# Altium project Course work.PrjPcb (part 3 of 3)
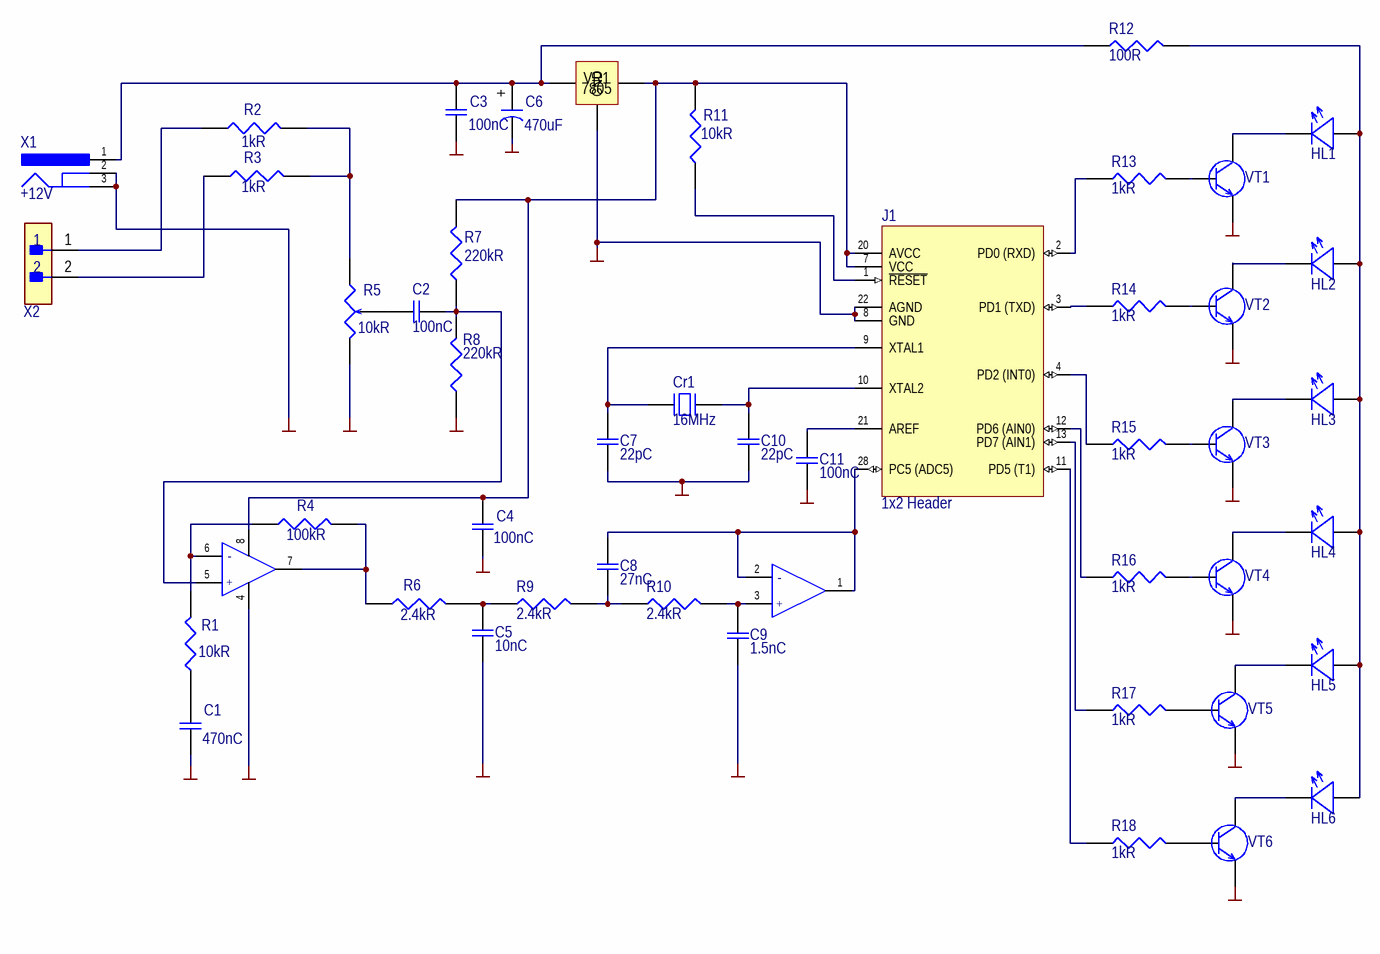
[diagram p2: CW.SchDoc]

## Sheet CW.SchDoc (continued)

### Library data of the parts (continued)
VT1-VT6 = BC639: TRANS NPN 80V 1A TO-92; Manufacturer: ON Semiconductor / Fairchild; Max Power Dissipation: 625mW; Transition Frequency: 200MHz; Emitter Base Voltage (VEBO): 5V; Collector Emitter Saturation Voltage: 500mV; Element Configuration: Single; Frequency: 100MHz; hFE Min: 40; Number of Elements: 1; Power Dissipation: 1W; Supplier 1: Avnet; Supplier Part Number 1: BC639; Manufacturer Part Number: BC639; RoHS: No; Category: BJTs; Stock 1: 10708; Pricing 1: 5342=0,06646, 5400=0,06552, 11000=0,06365, 27000=0,06224, 54000=0,05990, 270000=0,05850, 540000=0,05710 (USD); Mount: Through Hole; Case/Package: TO-92; Number of Pins: 3; Contact Plating: Copper,Tin,Silver; Weight: 0.201g; Min Operating Temperature: -55°C; Max Operating Temperature: 150°C; Package Quantity: 5000; Collector Emitter Voltage (VCEO): 80V; Packaging: Bulk; Max Collector Current: 1A; Polarity: NPN; Collector Emitter Breakdown Voltage: 80V; Gain Bandwidth Product: 200MHz; Voltage Rating (DC): 80V; Current Rating: 1A; Collector Base Voltage (VCBO): 80V; Max Breakdown Voltage: 80V; Collector-emitter Voltage-Max: 500mV; Series: -; Termination: Through Hole; Lead Free: Lead Free; REACH SVHC: No SVHC; RoHS Compliant: No; ComponentLink1URL: https://datasheet.ciiva.com/982/bc639-982480.pdf?src-supplier=Digi-Key; ComponentLink1Description: https://datasheet.ciiva.com/982/bc639-982480.pdf?src-supplier=Digi-Key; ComponentLink2URL: https://datasheet.ciiva.com/986/bc635-637-639rev5-986450.pdf?src-supplier=Digi-Key; ComponentLink2Description: https://datasheet.ciiva.com/986/bc635-637-639rev5-986450.pdf?src-supplier=Digi-Key; ComponentLink3URL: https://datasheet.ciiva.com/17179/bc63916-17179413.pdf?src-supplier=Future+Electronics; ComponentLink3Description: https://datasheet.ciiva.com/17179/bc63916-17179413.pdf?src-supplier=Future+Electronics; ComponentLink4URL: https://datasheet.ciiva.com/1195/5224-1195640.pdf?src-supplier=Element14; ComponentLink4Description: https://datasheet.ciiva.com/1195/5224-1195640.pdf?src-supplier=Element14; ComponentLink5URL: https://datasheet.ciiva.com/1195/5224-1195641.pdf?src-supplier=Element14; ComponentLink5Description: https://datasheet.ciiva.com/1195/5224-1195641.pdf?src-supplier=Element14; ComponentLink6URL: https://datasheet.ciiva.com/1217/5224-1217209.pdf?src-supplier=Farnell; ComponentLink6Description: https://datasheet.ciiva.com/1217/5224-1217209.pdf?src-supplier=Farnell
X1 = KLDX-0202-A: KYCON - KLDX-0202-A - DC Power Connector, Jack, 3.5 A, 2 mm, PCB Mount, Through Hole; Number of Contacts: 2; Gender: Female; Current Rating: 3.5A; Voltage Rating: 24V; Insulation Resistance: 100MR; Supplier 1: Digi-Key; Supplier Part Number 1: 2092-KLDX-0202-A-ND; Manufacturer: Kycon; Manufacturer Part Number: KLDX-0202-A; RoHS: Yes; Category: Connectors; Stock 1: 10383; Pricing 1: 1=0,54000, 10=0,50600, 25=0,45560, 50=0,40480, 100=0,38790, 250=0,35420, 500=0,33734, 1000=0,27831, 2500=0,25300 (USD); Mount: Through Hole; Contact Material: Brass; Contact Plating: Tin; Housing Material: PBT; Color: Black; Min Operating Temperature: -25°C; Max Operating Temperature: 85°C; Packaging: Bag; Termination: Solder; Orientation: Right Angle; Package Quantity: 500; Connector Type: Power; Contact Gender: Female; Series: KLDX; Voltage Rating (DC): 24V; Radiation Hardening: No; Flammability Rating: UL94 V-0; RoHS Compliant: Yes; ComponentLink1URL: http://www.mouser.com/ds/2/222/KLDX_0202_LT-334784.pdf?src-supplier=Mouser; ComponentLink1Description: http://www.mouser.com/ds/2/222/KLDX_0202_LT-334784.pdf?src-supplier=Mouser; ComponentLink2URL: http://domino2.kycon.com/catalog_PDF/KLDX_0202.pdf?src-supplier=Avnet; ComponentLink2Description: http://domino2.kycon.com/catalog_PDF/KLDX_0202.pdf?src-supplier=Avnet; ComponentLink3URL: http://domino2.kycon.com/catalog_PDF/KLDX_0202.pdf?src-supplier=Avnet+Europe; ComponentLink3Description: http://domino2.kycon.com/catalog_PDF/KLDX_0202.pdf?src-supplier=Avnet+Europe
X2 = 43650-0229: MOLEX - 43650-0229 - Wire-To-Board Connector, 3 mm, 2 Contacts, Header, Micro-Fit 3.0 43650 Series, Through Hole, 1 Rows; Number of Contacts: 2; Gender: Male; Voltage Rating: 600V; Current Rating: 5A; Pitch: 3mm; Glow Wire Compliant: Compliant; Supplier 1: Digi-Key; Supplier Part Number 1: WM10662-ND; Manufacturer: Molex; Manufacturer Part Number: 43650-0229; RoHS: Yes; Category: Headers and Wire Housings; Stock 1: 5963; Pricing 1: 1=1,21000, 10=1,00100, 440=0,83407, 3264=0,60469, 6528=0,58384, 13056=0,54214 (USD); Mount: Through Hole; Contact Plating: Gold; Contact Material: Brass; Housing Material: Thermoplastic; Packaging: Tray; Termination: Through Hole; Orientation: Vertical; Package Quantity: 3264; Series: 43650; Number of Rows: 1; Number of Positions: 2; Number of Circuits: 2; Radiation Hardening: No; RoHS Compliant: Yes; Halogen Free: Low Halogen; ComponentLink1URL: https://datasheet.ciiva.com/13564/0436500229-pcb-headers-148697-13564517.pdf?src-supplier=Mouser; ComponentLink1Description: https://datasheet.ciiva.com/13564/0436500229-pcb-headers-148697-13564517.pdf?src-supplier=Mouser; ComponentLink2URL: https://datasheet.ciiva.com/16654/0436500229-pcb-headers-16654485.pdf?src-supplier=Avnet+Europe; ComponentLink2Description: https://datasheet.ciiva.com/16654/0436500229-pcb-headers-16654485.pdf?src-supplier=Avnet+Europe